# Altium schematic sheet I2C Serial ID EEPROM.SchDoc: I2C Serial ID EEprom
size 292 x 193 mm; DocumentNumber: 36; SheetNumber: 14; SheetTotal: 28
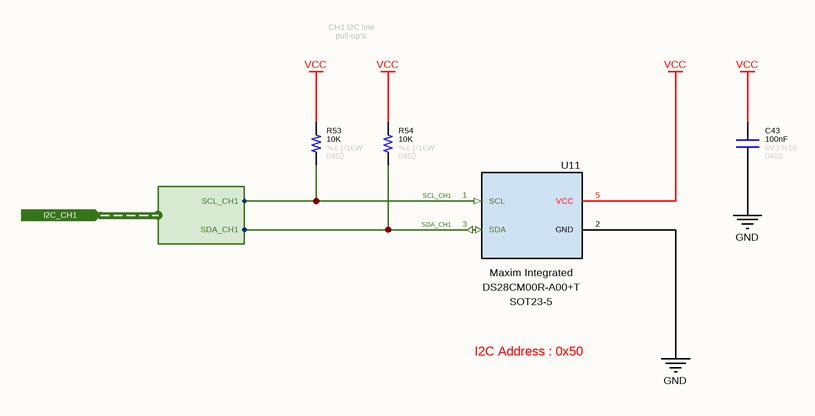
[diagram p0: I2C Serial ID EEPROM.SchDoc]

## Parts
C43  value 100nF  Tolerance: %10  Voltage: 6V3  Case: 0402  [CAPACITOR_0402]  (hidden comment: Capacitor - 100nF [0402] (Ceramic))
R53  value 10K  Tolerance: %1  Case: 0402  Power: 1/16W  [RESISTOR_0402]  (hidden comment: 10K - 0402 - %1 - 1/16W)
R54  value 10K  Tolerance: %1  Case: 0402  Power: 1/16W  [RESISTOR_0402]  (hidden comment: 10K - 0402 - %1 - 1/16W)
U11  Manufacturer Name: Maxim Integrated  Case: SOT23-5  [SOT-23-5]  (hidden comment: DS28CM00R-A00+T)

## Ports
I2C_CH1 (in, harness I2C_CH1)

## Harnesses
I2C_CH1: SDA_CH1, SCL_CH1

## Nets
GND: C43.1 U11.2(GND)
VCC: C43.2 R53.2 R54.2 U11.5(VCC)
SCL_CH1: R53.1 U11.1(SCL) ; port I2C_CH1.SCL_CH1
SDA_CH1: R54.1 U11.3(SDA) ; port I2C_CH1.SDA_CH1

Not connected (* = marked no-connect by the designer): U11 4(NC)

## Notes on the sheet
- CH1 I2C line pull-up's.
- I2C Address : 0x50
- © 2021 All rights reserved.
  This document may not, in whole or in part, be copied, photocopied, reproduced, translated or converted to any electronic or machine readable from without prior written permission of Mehmet Günce Akkoyun.
  Engineer contact : akkoyun@me.com
- Property of
- Engineer :
- Date :
- Size :
- A4
- Time :
- Project :
- Page :
- /
- Customer :
- Product ID :
- Module ID :
- Version :
- File :
- Revision :

## Library data of the parts
C43 = Capacitor - 100nF [0402-6V3]: Capacitor - 100nF [0402-6V3] (Ceramic); Manufacturer Name: AVX; Manufacturer Part Number: 04026D104KAT4A; ComponentLink1Description: Mouser; ComponentLink1URL: https://www.mouser.com.tr/ProductDetail/AVX/04026D104KAT4A?qs=sGAEpiMZZMs0AnBnWHyRQPg4iYkCw7IMED%2F4kpqgf7w%3D; ComponentLink2Description: DataSheet; ComponentLink2URL: https://www.mouser.com.tr/datasheet/2/40/cx5r-776519.pdf
R53 R54 = Resistor - 10K [0402]: Thick Film Resistors - SMD 1/16 W 10 KOhm 1%; Manufacturer Name: Vishay; Manufacturer Part Number: CRCW040210K0FKED; ComponentLink1Description: DataSheet; ComponentLink1URL: https://www.mouser.com.tr/datasheet/2/427/dcrcwe3-1762152.pdf; ComponentLink2Description: Mouser; ComponentLink2URL: https://www.mouser.com.tr/ProductDetail/Vishay-Dale/CRCW040210K0FKED?qs=sGAEpiMZZMu61qfTUdNhG2DpbjADlD3GcalbOv9utCY%3D
U11 = IC - DS28C: Security ICs / Authentication ICs I C/SMBus Silicon Serial Number; Data Bus Width: 64 bit; RoHS: Yes; Product Type: Security ICs; Manufacturer Part Number: DS28CM00R-A00+T